# EAGLE design divider (EAGLE 9.5.2)
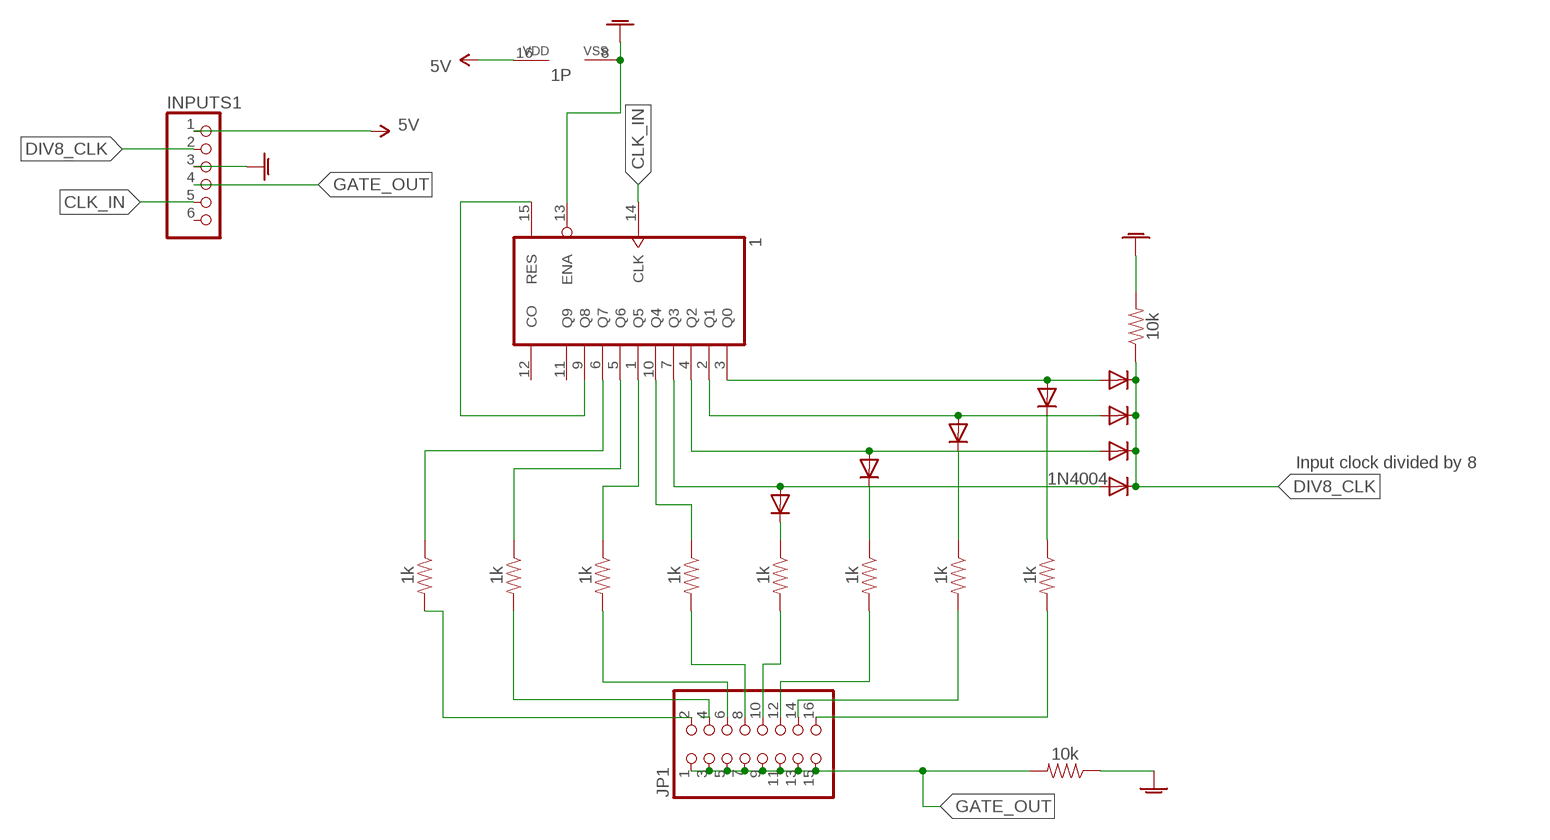
[diagram p0: schematic, sheet 1]

## Parts
1  4017N  [DIL16]
D9  1N4004  [DO41-10]
D10  1N4004  [DO41-10]
D11  1N4004  [DO41-10]
D12  1N4004  [DO41-10]
D13  1N4004  [DO41-10]
D14  1N4004  [DO41-10]
D15  1N4004  [DO41-10]
D16  1N4004  [DO41-10]
INPUTS1  PINHD-1X6  [1X06]
JP1  PINHD-2X8  [2X08]
R40  10k  10KOHM-HORIZ-1/4W-1%  [AXIAL-0.3]
R48  1k  10KOHM-HORIZ-1/4W-1%  [AXIAL-0.3]
R49  1k  10KOHM-HORIZ-1/4W-1%  [AXIAL-0.3]
R50  1k  10KOHM-HORIZ-1/4W-1%  [AXIAL-0.3]
R51  1k  10KOHM-HORIZ-1/4W-1%  [AXIAL-0.3]
R52  1k  10KOHM-HORIZ-1/4W-1%  [AXIAL-0.3]
R53  1k  10KOHM-HORIZ-1/4W-1%  [AXIAL-0.3]
R54  1k  10KOHM-HORIZ-1/4W-1%  [AXIAL-0.3]
R55  1k  10KOHM-HORIZ-1/4W-1%  [AXIAL-0.3]
R56  10k  10KOHM-HORIZ-1/4W-1%  [AXIAL-0.3]

## Nets
5V: 1.16(VDD) INPUTS1.1
CLK_IN: 1.14(CLK) INPUTS1.5
DIV8_CLK: D9.C D10.C D11.C D12.C INPUTS1.2 R40.P$1
GATE_OUT: INPUTS1.4 JP1.1 JP1.3 JP1.5 JP1.7 JP1.9 JP1.11 JP1.13 JP1.15 R56.P$2
GND: 1.8(VSS) 1.13(ENA) ; supply symbol labelled GNDA
GNDA: INPUTS1.3 R40.P$2 R56.P$1
N$1: JP1.4 R49.P$2
N$2: JP1.2 R48.P$2
N$56: 1.9(Q8) 1.15(RES)
N$57: 1.3(Q0) D9.A D16.A
N$58: 1.2(Q1) D10.A D13.A
N$59: 1.4(Q2) D11.A D14.A
N$60: 1.7(Q3) D12.A D15.A
N$61: 1.6(Q7) R48.P$1
N$63: JP1.6 R50.P$2
N$64: 1.10(Q4) R51.P$1
N$65: JP1.10 R52.P$2
N$66: JP1.12 R53.P$2
N$67: JP1.14 R54.P$2
N$68: JP1.16 R55.P$2
N$69: 1.5(Q6) R49.P$1
N$70: 1.1(Q5) R50.P$1
N$71: JP1.8 R51.P$2
N$72: D15.C R52.P$1
N$73: D14.C R53.P$1
N$74: D13.C R54.P$1
N$75: D16.C R55.P$1
Unconnected: 1.11(Q9) 1.12(CO) INPUTS1.6

## Notes on the sheet
- Input clock divided by 8

## Library data of the parts
1 = 40xx:4017: COUNTER/DIVIDER
D9-D16 = adafruit:1N4004: DIODE General purpose 1N400x type rectifier (With bigger pads) http://www.ladyada.net/library/pcb/eaglelibrary.html
INPUTS1 = pinhead:PINHD-1X6: PIN HEADER
JP1 = pinhead:PINHD-2X8: PIN HEADER
R40 R56 = SparkFun-Resistors:10KOHM: 10kΩ resistor A resistor is a passive two-terminal electrical component that implements electrical resistance as a circuit element. Resistors act to reduce current flow, and, at the same time, act to lower voltage levels within circuits. - Wikipedia; PROD_ID: RES-12183
R48-R55 = SparkFun-Resistors:10KOHM: 10kΩ resistor A resistor is a passive two-terminal electrical component that implements electrical resistance as a circuit element. Resistors act to reduce current flow, and, at the same time, act to lower voltage levels within circuits. - Wikipedia; PROD_ID: RES-12183; VALUE: 10k

## Board
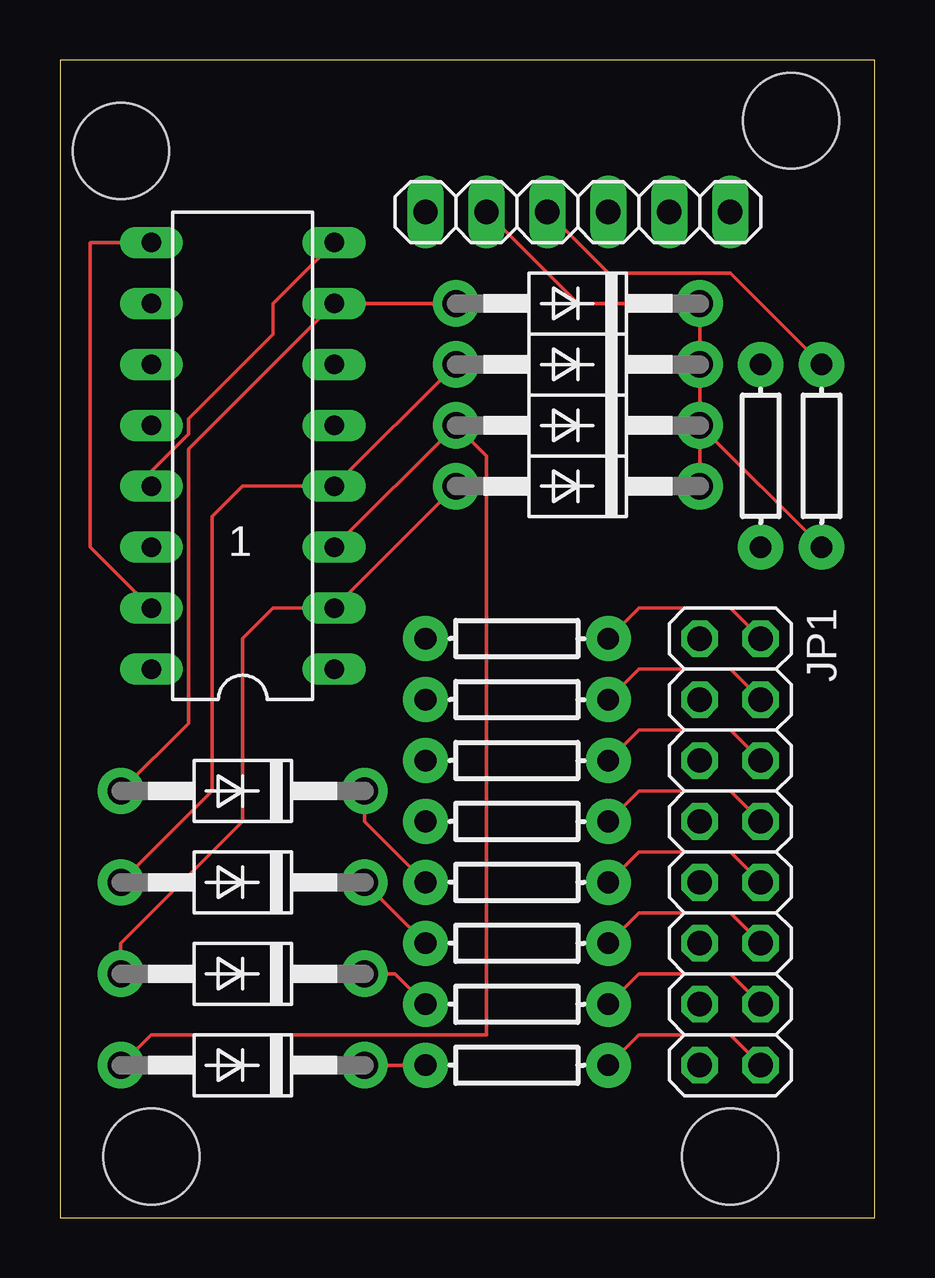
[diagram p1: board, top side]
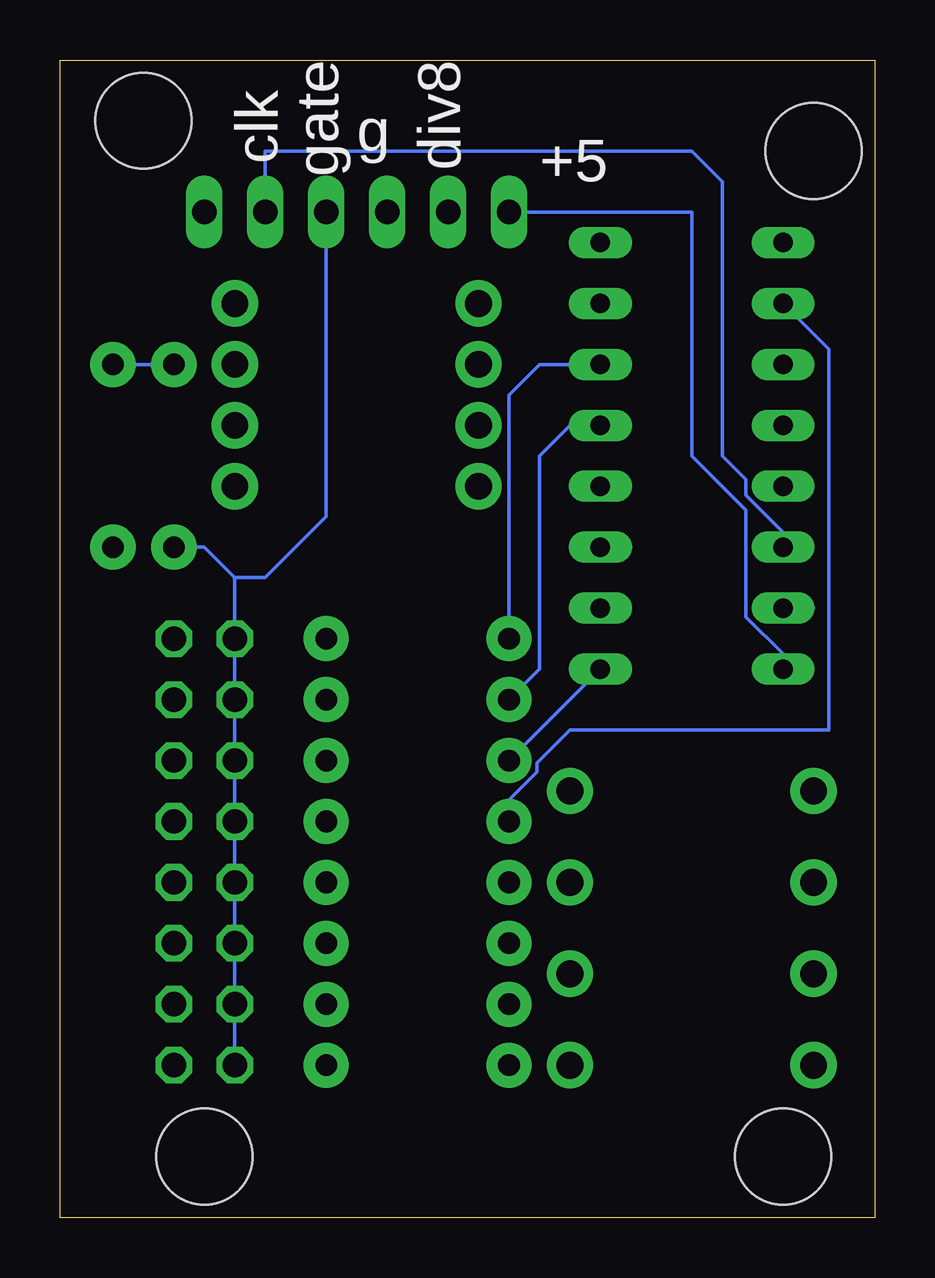
[diagram p2: board, bottom side, seen from below]

Size 33.96 x 48.25 mm. Coordinates in mm from the lower left corner, seen from the top.
Outline: 0,0 33.96,0 33.96,48.25 0,48.25 0,0
Copper layers (1*16): Top 0.035mm / dielectric 1.5mm / Bottom 0.035mm
Design rules "default": minimum track width 6mil, minimum drill 0.35mm, track to track 6mil, track to pad 6mil, pad to pad 6mil, via to via 6mil, smd to smd 6mil, copper to edge 40mil, drill to drill 6mil, minimum pad ring 10mil, minimum via ring 8mil, stop-mask expansion 4mil, vias tented up to drill 0mil, thermal gap 10mil
Holes 4 mm at 2.54,44.45 30.48,45.72 27.94,2.54 3.81,2.54

### Footprints (pad centres in the part's own frame; a part is rotated, then mirrored left to right if it is on the bottom)
DIL16 = drill 0.813 long: 1 -8.89,-3.81; 2 -6.35,-3.81; 3 -3.81,-3.81; 4 -1.27,-3.81; 5 1.27,-3.81; 6 3.81,-3.81; 7 6.35,-3.81; 8 8.89,-3.81; 9 8.89,3.81; 10 6.35,3.81; 11 3.81,3.81; 12 1.27,3.81; 13 -1.27,3.81; 14 -3.81,3.81; 15 -6.35,3.81; 16 -8.89,3.81
DO41-10 = drill 1.118 pad 1.93: A 5.08,0; C -5.08,0
1X06 = drill 1.016 long: 1 -6.35,0; 2 -3.81,0; 3 -1.27,0; 4 1.27,0; 5 3.81,0; 6 6.35,0
2X08 = drill 1.016 octagon: 1 -8.89,-1.27; 2 -8.89,1.27; 3 -6.35,-1.27; 4 -6.35,1.27; 5 -3.81,-1.27; 6 -3.81,1.27; 7 -1.27,-1.27; 8 -1.27,1.27; 9 1.27,-1.27; 10 1.27,1.27; 11 3.81,-1.27; 12 3.81,1.27; 13 6.35,-1.27; 14 6.35,1.27; 15 8.89,-1.27; 16 8.89,1.27
AXIAL-0.3 = drill 0.9 pad 1.88: P$1 -3.81,0; P$2 3.81,0

### Placement (x,y rotation side)
1  7.62,31.75 90 top
D9  21.59,33.02 180 top
D10  21.59,30.48 180 top
D11  21.59,35.56 180 top
D12  21.59,38.1 180 top
D13  7.62,10.16 180 top
D14  7.62,13.97 180 top
D15  7.62,17.78 180 top
D16  7.62,6.35 180 top
INPUTS1  21.59,41.91 0 top
JP1  27.94,15.24 270 top
R40  31.75,31.75 90 top
R48  19.05,24.13 0 top
R49  19.05,21.59 0 top
R50  19.05,19.05 0 top
R51  19.05,16.51 0 top
R52  19.05,13.97 0 top
R53  19.05,11.43 0 top
R54  19.05,8.89 0 top
R55  19.05,6.35 0 top
R56  29.21,31.75 270 top

### Tracks (layer width: path | path; a pad name or v marks a point on that pad's centre or on a via)
5V
  Bottom 0.152: 1.16 3.81,23.48 5.36,25.03 5.36,29.49 7.62,31.75 7.62,41.91 INPUTS1.1
CLK_IN
  Bottom 0.152: 1.14 3.81,28.56 5.36,30.11 5.36,30.76 6.35,31.75 6.35,43.18 7.62,44.45 25.4,44.45 INPUTS1.5
DIV8_CLK
  Top 0.152: D9.C D10.C | D9.C D11.C D12.C 21.59,38.1 INPUTS1.2 | R40.P$1 D9.C
GATE_OUT
  Bottom 0.152: JP1.15 JP1.13 JP1.11 JP1.9 JP1.7 JP1.5 JP1.3 JP1.1 26.67,26.67 | 26.67,26.67 27.94,27.94 R56.P$2 | 26.67,26.67 25.4,26.67 22.86,29.21 INPUTS1.4
GND
  Top 0.152: 1.13 3.81,31.1 5.36,32.65 5.36,33.3 8.89,36.83 8.89,38.1 1.8
GNDA
  Top 0.152: R40.P$2 27.94,39.37 22.86,39.37 INPUTS1.3
  Bottom 0.152: R56.P$1 R40.P$2
N$1
  Top 0.152: R49.P$2 24.13,22.86 27.94,22.86 JP1.4
N$2
  Top 0.152: R48.P$2 24.13,25.4 27.94,25.4 JP1.2
N$56
  Top 0.152: 1.15 1.27,27.94 1.27,40.64 1.9
  Bottom 0.152: 2.54,25.4 1.15
N$57
  Top 0.152: 1.3 D9.A 17.78,31.75 17.78,7.62 3.81,7.62 D16.A
  Bottom 0.152: 10.16,27.94 1.3
N$58
  Top 0.152: D10.A 1.2 8.89,25.4 7.62,24.13 7.62,16.51 2.54,11.43 D13.A
N$59
  Top 0.152: D11.A 1.4 7.62,30.48 6.35,29.21 6.35,17.78 D14.A
N$60
  Top 0.152: D12.A 1.7 5.36,32.03 5.36,20.6 D15.A
N$61
  Bottom 0.152: 1.6 13.97,35.56 15.24,34.29 R48.P$1
N$63
  Top 0.152: R50.P$2 24.13,20.32 27.94,20.32 JP1.6
N$64
  Bottom 0.152: 1.10 1.92,36.21 1.92,20.32 12.7,20.32 14.07,18.95 14.07,18.57 15.24,17.4 R51.P$1
N$65
  Top 0.152: R52.P$2 24.13,15.24 27.94,15.24 JP1.10
N$66
  Top 0.152: R53.P$2 24.13,12.7 27.94,12.7 JP1.12
N$67
  Top 0.152: R54.P$2 24.13,10.16 27.94,10.16 JP1.14
N$68
  Top 0.152: R55.P$2 24.13,7.62 27.94,7.62 JP1.16
N$69
  Bottom 0.152: 1.5 12.7,33.02 13.97,31.75 13.97,22.86 R49.P$1
N$70
  Bottom 0.152: 1.1 R50.P$1
N$71
  Top 0.152: R51.P$2 24.13,17.78 27.94,17.78 JP1.8
N$72
  Top 0.152: D15.C 12.7,16.51 R52.P$1
N$73
  Top 0.152: D14.C R53.P$1
N$74
  Top 0.152: D13.C 13.97,10.16 R54.P$1
N$75
  Top 0.152: D16.C R55.P$1

### Text on the board
bPlace: div8 | gate | clk | g | +5